# EAGLE schematic DCCInterfaceShieldNano (EAGLE 9.6.2)
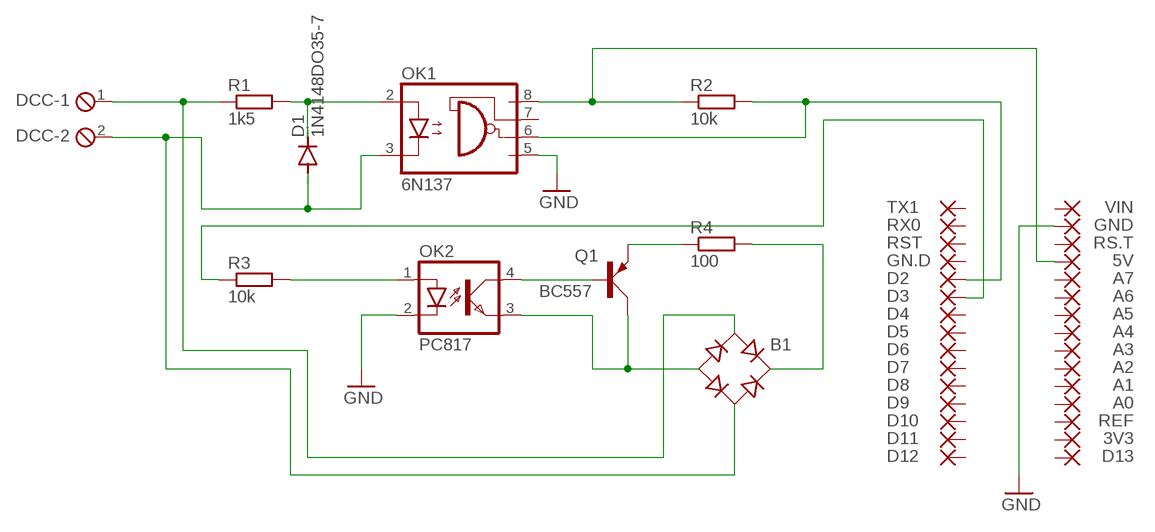
[diagram p0: schematic, sheet 1]

## Parts
3V3  1,6/0,8  [1,6/0,8]
5V  1,6/0,8  [1,6/0,8]
A0  1,6/0,8  [1,6/0,8]
A1  1,6/0,8  [1,6/0,8]
A2  1,6/0,8  [1,6/0,8]
A3  1,6/0,8  [1,6/0,8]
A4  1,6/0,8  [1,6/0,8]
A5  1,6/0,8  [1,6/0,8]
A6  1,6/0,8  [1,6/0,8]
A7  1,6/0,8  [1,6/0,8]
B1  RB1A  [RB1A]
D1  1N4148DO35-7  [DO35-7]
D2  1,6/0,8  [1,6/0,8]
D3  1,6/0,8  [1,6/0,8]
D4  1,6/0,8  [1,6/0,8]
D5  1,6/0,8  [1,6/0,8]
D6  1,6/0,8  [1,6/0,8]
D7  1,6/0,8  [1,6/0,8]
D8  1,6/0,8  [1,6/0,8]
D9  1,6/0,8  [1,6/0,8]
D10  1,6/0,8  [1,6/0,8]
D11  1,6/0,8  [1,6/0,8]
D12  1,6/0,8  [1,6/0,8]
D13  1,6/0,8  [1,6/0,8]
DCC  MPT2  [2POL254]
GN.D  1,6/0,8  [1,6/0,8]
GND  1,6/0,8  [1,6/0,8]
OK1  6N137  [DIL08]
OK2  PC817  [DIL04]
Q1  BC557  [SOT54A]
R1  1k5  R-EU_0204/2V  [0204V]
R2  10k  R-EU_0204/2V  [0204V]
R3  10k  R-EU_0204/2V  [0204V]
R4  100  R-EU_0204/2V  [0204V]
REF  1,6/0,8  [1,6/0,8]
RS.T  1,6/0,8  [1,6/0,8]
RST  1,6/0,8  [1,6/0,8]
RX0  1,6/0,8  [1,6/0,8]
TX1  1,6/0,8  [1,6/0,8]
VIN  1,6/0,8  [1,6/0,8]

## Nets
GND [GND]: GND.1(P) OK1.5(GND) OK2.2(C)
N$1: 5V.1(P) OK1.8(VCC) R2.1
N$3: D1.C OK1.2(A) R1.2
N$5: D2.1(P) OK1.6(VO) R2.2
N$6 [DCC]: B1.AC1 DCC.1 R1.1
N$7: OK2.1(A) R3.2
N$8: OK2.4(COL) Q1.B
N$9: B1.+ R4.2
N$10: B1.- OK2.3(EMIT) Q1.C
N$11: Q1.E R4.1
N$12: D3.1(P) R3.1
N$13 [DCC]: B1.AC2 D1.A DCC.2 OK1.3(C)
Unconnected: 3V3.1(P) A0.1(P) A1.1(P) A2.1(P) A3.1(P) A4.1(P) A5.1(P) A6.1(P) A7.1(P) D4.1(P) D5.1(P) D6.1(P) D7.1(P) D8.1(P) D9.1(P) D10.1(P) D11.1(P) D12.1(P) D13.1(P) GN.D.1(P) OK1.7(VE) REF.1(P) RS.T.1(P) RST.1(P) RX0.1(P) TX1.1(P) VIN.1(P)

## Library data of the parts
3V3 5V A0 A1-A7 D2-D13 GN.D GND REF RS.T RST RX0 TX1 VIN = wirepad:1,6/0,8: THROUGH-HOLE PAD
B1 = rectifier:RB1A: RECTIFIER 1 A
D1 = diode:1N4148: DIODE high speed (Philips)
DCC = con-phoenix-254:MPT2: PHOENIX CONNECTOR; OC_FARNELL: unknown; OC_NEWARK: unknown
OK1 = optocoupler:6N137: MOTOROLA OPTO COUPLER; MPN: 6N137; OC_FARNELL: 1328376; OC_NEWARK: 52M1895
OK2 = optocoupler:PC817: SHARP OPTO COUPLER; MPN: PC817X4J000F; OC_FARNELL: 9707727; OC_NEWARK: 97K7059
Q1 = transistor-small-signal:BC557: PNP TRANSISTOR
R1-R4 = rcl:R-EU_: RESISTOR, European symbol; SPICEPREFIX: R

## Net classes
0 default: width 0.305 mm, clearance 0.305 mm
1 GND: width 0.508 mm, clearance 0.305 mm
2 DCC: width 0.381 mm, clearance 0.305 mm